# Altium schematic sheet [02] PMIC_POWER.SchDoc (part 1 of 3)
size B; DocumentNumber: 02; SheetNumber: 02; SheetTotal: 3
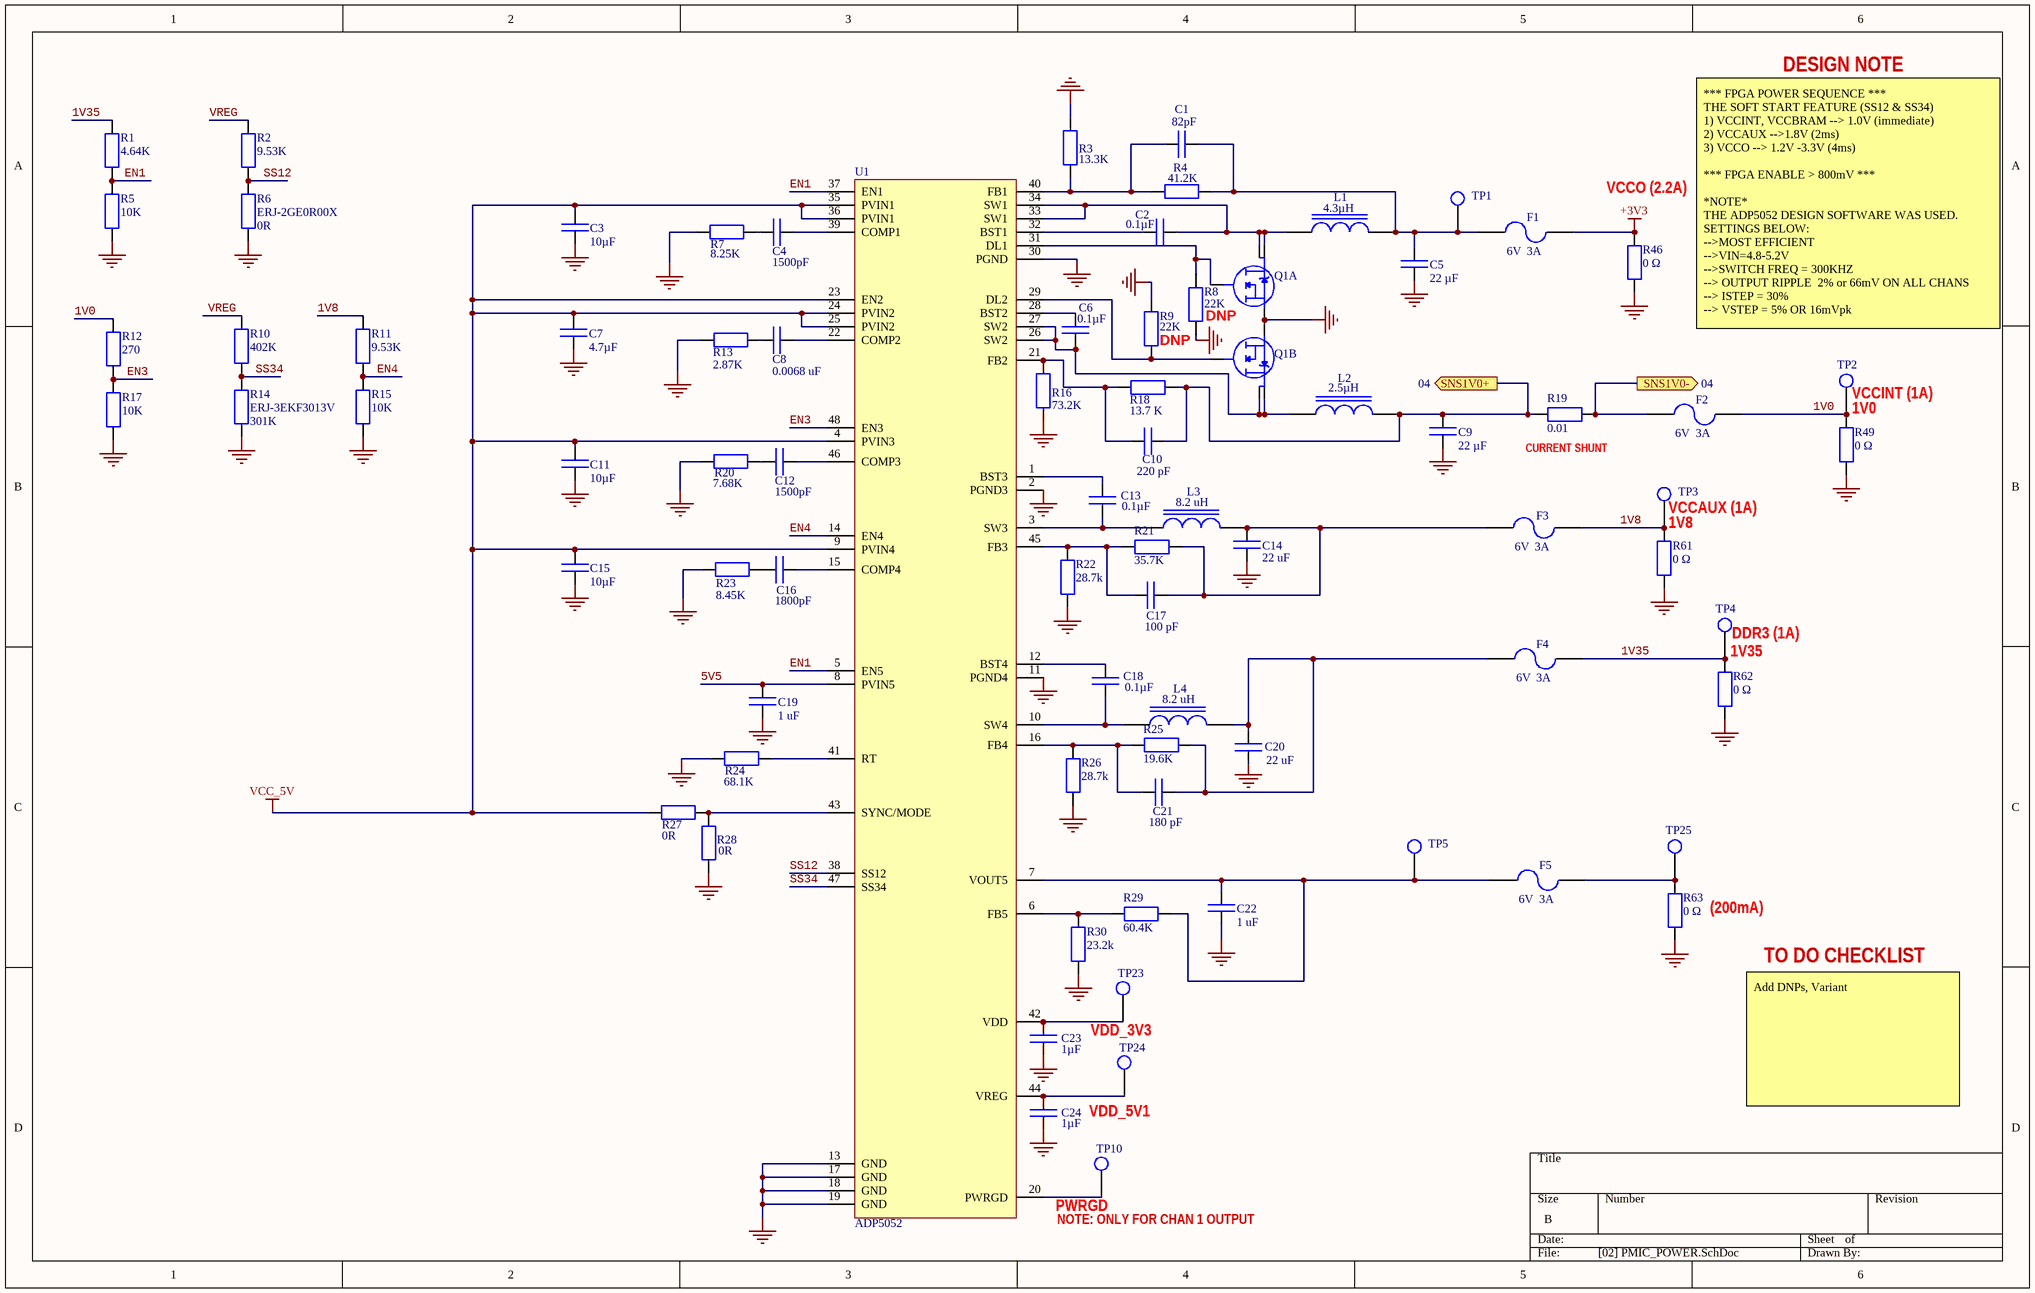
[diagram p0: [02] PMIC_POWER.SchDoc]

## Parts
C1  Capacitance: 82pF  [R0402]  (hidden comment: GCM1555C1H820FA16D)
C2  Capacitance: 0.1µF  [R0402]  (hidden comment: CC0402KRX7R6BB104)
C3  Capacitance: 10µF  [C1206]  (hidden comment: C3216X5R1C106M160AA)
C4  Capacitance: 1500pF  [R0402]  (hidden comment: GCM155R71H152KA37D)
C5  Capacitance: 22 µF  [C1206]  (hidden comment: 12063D226KAT2A)
C6  Capacitance: 0.1µF  [R0402]  (hidden comment: CC0402KRX7R6BB104)
C7  Capacitance: 4.7µF  [C0805_1]  (hidden comment: C2012X5R1C475K060AC)
C8  Capacitance Value: 0.0068 uF  [R0402]  (hidden comment: GCM155R71H682KA55D)
C9  Capacitance: 22 µF  [C1206]  (hidden comment: 12063D226KAT2A)
C10  Capacitance Value: 220 pF  [R0402]  (hidden comment: GCM155R71H221KA37D)
C11  Capacitance: 10µF  [C1206]  (hidden comment: C3216X5R1C106M160AA)
C12  Capacitance: 1500pF  [R0402]  (hidden comment: GCM155R71H152KA37D)
C13  Capacitance: 0.1µF  [R0402]  (hidden comment: CC0402KRX7R6BB104)
C14  Capacitance Value: 22 uF  [C0805_1]  (hidden comment: GRM21BR60J226ME39K)
C15  Capacitance: 10µF  [C1206]  (hidden comment: C3216X5R1C106M160AA)
C16  Capacitance: 1800pF  [C0805_1]  (hidden comment: GRM2165C2A182JA01D)
C17  Capacitance: 100 pF  [R0402]  (hidden comment: C0402C101K4GACTU)
C18  Capacitance: 0.1µF  [R0402]  (hidden comment: CC0402KRX7R6BB104)
C19  Capacitance: 1 uF  [C0603_1]  (hidden comment: C0603C105K8RACTU)
C20  Capacitance Value: 22 uF  [C0805_1]  (hidden comment: GRM21BR60J226ME39K)
C21  Capacitance: 180 pF  [R0402]  (hidden comment: C0402C181K5RACTU)
C22  Capacitance: 1 uF  [C0603_1]  (hidden comment: C0603C105K8RACTU)
C23  Capacitance: 1µF  (hidden comment: CC0402KRX5R5BB105)
C24  Capacitance: 1µF  (hidden comment: CC0402KRX5R5BB105)
F1  Voltage - Max: 6V  Current - Hold (Ih) (Max): 3A  [C1206 - PTC]  (hidden comment: MF-NSML300-2)
F2  Voltage - Max: 6V  Current - Hold (Ih) (Max): 3A  [C1206 - PTC]  (hidden comment: MF-NSML300-2)
F3  Voltage - Max: 6V  Current - Hold (Ih) (Max): 3A  [C1206 - PTC]  (hidden comment: MF-NSML300-2)
F4  Voltage - Max: 6V  Current - Hold (Ih) (Max): 3A  [C1206 - PTC]  (hidden comment: MF-NSML300-2)
F5  Voltage - Max: 6V  Current - Hold (Ih) (Max): 3A  [C1206 - PTC]  (hidden comment: MF-NSML300-2)
L1  Inductance: 4.3µH  [14.3uH_10_2mmX10_2mmX4mm]  (hidden comment: 7443552430)
L2  Inductance: 2.5µH  [2.5UH_10_2MMX10_2MM]  (hidden comment: 7447798250)
L3  Inductance: 8.2 uH  [8.2UH_5.28MMX5.28MM]  (hidden comment: XAL5050-822MEB)
L4  Inductance: 8.2 uH  [8.2UH_5.28MMX5.28MM]  (hidden comment: XAL5050-822MEB)
Q1  IRF8910  [8-SOIC]  (value not drawn)  (parts A,B of 2)
R1  Resistance: 4.64K  [R0603]  (hidden comment: ERJ-3EKF4641V)
R2  Resistance (Ohms): 9.53K  [R0603]  (hidden comment: ERJ-3EKF9531V)
R3  Resistance (Ohms): 13.3K  [R0805]  (hidden comment: CRCW080513K3FKEA)
R4  Resistance: 41.2K  [R0805]  (hidden comment: CRCW080541K2FKEA)
R5  Resistance: 10K  [R0603]  (hidden comment: ERJ-3EKF1002V)
R6  ERJ-2GE0R00X  Resistance (Ohms): 0R  [R0603]
R7  Resistance: 8.25K  [R0805]  (hidden comment: ERJ-6ENF8251V)
R8  Resistance: 22K  [R0402]  (hidden comment: CRCW040222K0FKED)
R9  Resistance: 22K  [R0402]  (hidden comment: CRCW040222K0FKED)
R10  Resistance (Ohms): 402K  [R0603]  (hidden comment: ERJ-3EKF4023V)
R11  Resistance (Ohms): 9.53K  [R0603]  (hidden comment: ERJ-3EKF9531V)
R12  Resistance: 270  [R0603]  (hidden comment: ERJ-3EKF2700V)
R13  Resistance (Ohms): 2.87K  [R0805]  (hidden comment: RC0805FR-072K87L)
R14  ERJ-3EKF3013V  Resistance: 301K  [R0603]
R15  Resistance: 10K  [R0603]  (hidden comment: ERJ-3EKF1002V)
R16  Resistance: 73.2K  [R0402]  (hidden comment: ERJ-2RKF7322X)
R17  Resistance: 10K  [R0603]  (hidden comment: ERJ-3EKF1002V)
R18  Resistance: 13.7 K  [R0402]  (hidden comment: ERJ-2RKF1372X)
R19  Resistance (Ohms): 0.01  [R0603]  (hidden comment: ERJ-3LWFR010V)
R20  Resistance (Ohms): 7.68K  [R0805]  (hidden comment: ERJ-6ENF7681V)
R21  Resistance: 35.7K  [R0402]  (hidden comment: ERJ-2RKF3572X)
R22  Resistance (Ohms): 28.7k  [R0402]  (hidden comment: CRCW040228K7FKED)
R23  Resistance: 8.45K  [R0805]  (hidden comment: ERJ-6ENF8451V)
R24  Resistance: 68.1K  [R0402]  (hidden comment: ERJ-2RKF6812X)
R25  Resistance: 19.6K  [R0402]  (hidden comment: ERJ-2RKF1962X)
R26  Resistance (Ohms): 28.7k  [R0402]  (hidden comment: CRCW040228K7FKED)
R27  Resistance (Ohms): 0R  [R0603]  (hidden comment: ERJ-2GE0R00X)
R28  Resistance (Ohms): 0R  [R0603]  (hidden comment: ERJ-2GE0R00X)
R29  Resistance: 60.4K  [R0402]  (hidden comment: ERJ-2RKF6042X)
R30  Resistance (Ohms): 23.2k  [R0402]  (hidden comment: ERJ-2RKF2322X)
R46  Resistance: 0 Ω  [R0805]  (hidden comment: ERJ-6GEY0R00V)
R49  Resistance: 0 Ω  [R0805]  (hidden comment: ERJ-6GEY0R00V)
R61  Resistance: 0 Ω  [R0805]  (hidden comment: ERJ-6GEY0R00V)
R62  Resistance: 0 Ω  [R0805]  (hidden comment: ERJ-6GEY0R00V)
R63  Resistance: 0 Ω  [R0805]  (hidden comment: ERJ-6GEY0R00V)
TP1  5017  [TEST_POINT]  (value not drawn)
TP2  5017  [TEST_POINT]  (value not drawn)
TP3  5017  [TEST_POINT]  (value not drawn)
TP4  5017  [TEST_POINT]  (value not drawn)
TP5  5017  [TEST_POINT]  (value not drawn)
TP10  5017  [TEST_POINT]  (value not drawn)
TP23  5017  [TEST_POINT]  (value not drawn)
TP24  5017  [TEST_POINT]  (value not drawn)
TP25  5017  [TEST_POINT]  (value not drawn)
U1  ADP5052  [48-LFSCP]

## Ports
SNS1V0+ (out, see 04), SNS1V0- (out, see 04)

## Nets
+3V3: F1.2 R46.1
GND: C3.1 C5.1 C7.1 C9.1 C11.1 C14.1 C15.1 C19.1 C20.1 C22.1 C23.1 C24.1 Q1.1(S1) Q1.3(S2) R3.2 R5.1 R6.1 R7.1 R8.1 R9.2 R13.1 R14.1 R15.1 R16.1 R17.1 R20.1 R22.1 R23.1 R24.1 R26.1 R28.2 R30.1 R46.2 R49.2 R61.2 R62.2 R63.2 U1.2(PGND3) U1.11(PGND4) U1.13(GND) U1.17(GND) U1.18(GND) U1.19(GND) U1.30(PGND)
VCC_5V: C3.2 C7.2 C11.2 C15.2 R27.2 U1.4(PVIN3) U1.9(PVIN4) U1.23(EN2) U1.24(PVIN2) U1.25(PVIN2) U1.35(PVIN1) U1.36(PVIN1)
1V0: F2.2 R12.2 R49.1 TP2.1
1V8: F3.2 R11.2 R61.1 TP3.1
1V35: F4.2 R1.2 R62.1 TP4.1
5V5: C19.2 U1.8(PVIN5)
EN1: R1.1 R5.2 U1.5(EN5) U1.37(EN1)
EN3: R12.1 R17.2 U1.48(EN3)
EN4: R11.1 R15.2 U1.14(EN4)
SNS1V0+: C9.2 C10.1 L2.2 R18.1 R19.1 ; port SNS1V0+
SNS1V0-: F2.1 R19.2 ; port SNS1V0-
SS12: R2.1 R6.2 U1.38(SS12)
SS34: R10.1 R14.2 U1.47(SS34)
VREG: R2.2 R10.2
NetC1_1: C1.1 C5.2 F1.1 L1.2 R4.2 TP1.1
NetC1_2: C1.2 R3.1 R4.1 U1.40(FB1)
NetC2_1: C2.1 L1.1 Q1.7(D1) Q1.8(D1) U1.33(SW1) U1.34(SW1)
NetC2_2: C2.2 U1.32(BST1)
NetC4_1: C4.1 U1.39(COMP1)
NetC4_2: C4.2 R7.2
NetC6_1: C6.1 U1.28(BST2)
NetC6_2: C6.2 L2.1 Q1.5(D2) Q1.6(D2) U1.26(SW2) U1.27(SW2)
NetC8_1: C8.1 U1.22(COMP2)
NetC8_2: C8.2 R13.2
NetC10_2: C10.2 R16.2 R18.2 U1.21(FB2)
NetC12_1: C12.1 U1.46(COMP3)
NetC12_2: C12.2 R20.2
NetC13_1: C13.1 U1.1(BST3)
NetC13_2: C13.2 L3.1 U1.3(SW3)
NetC14_2: C14.2 C17.1 F3.1 L3.2 R21.2
NetC16_1: C16.1 U1.15(COMP4)
NetC16_2: C16.2 R23.2
NetC17_2: C17.2 R21.1 R22.2 U1.45(FB3)
NetC18_1: C18.1 U1.12(BST4)
NetC18_2: C18.2 L4.1 U1.10(SW4)
NetC20_2: C20.2 C21.1 F4.1 L4.2 R25.2
NetC21_2: C21.2 R25.1 R26.2 U1.16(FB4)
NetC22_2: C22.2 F5.1 R29.2 TP5.1 U1.7(VOUT5)
NetC23_2: C23.2 TP23.1 U1.42(VDD)
NetC24_2: C24.2 TP24.1 U1.44(VREG)
NetF5_2: F5.2 R63.1 TP25.1
NetQ1_2: Q1.2(G1) R8.2 U1.31(DL1)
NetQ1_4: Q1.4(G2) R9.1 U1.29(DL2)
NetR24_2: R24.2 U1.41(RT)
NetR27_1: R27.1 R28.1 U1.43(SYNC/MODE)
NetR29_1: R29.1 R30.2 U1.6(FB5)
NetTP10_1: TP10.1 U1.20(PWRGD)

## Notes on the sheet
- DESIGN NOTE
- VCCO (2.2A)
- (near R9) DNP
- (near Q1) DNP
- *** FPGA POWER SEQUENCE ***
  THE SOFT START FEATURE (SS12 & SS34)
  1) VCCINT, VCCBRAM --> 1.0V (immediate)
  2) VCCAUX -->1.8V (2ms)
  3) VCCO --> 1.2V -3.3V (4ms)
  *** FPGA ENABLE > 800mV ***
  *NOTE*
  THE ADP5052 DESIGN SOFTWARE WAS USED. SETTINGS BELOW:
  -->MOST EFFICIENT
  -->VIN=4.8-5.2V
  -->SWITCH FREQ = 300KHZ
  --> OUTPUT RIPPLE  2% or 66mV ON ALL CHANS
  --> ISTEP = 30%
  --> VSTEP = 5% OR 16mVpk
- (near TP2) VCCINT (1A)
- 1V0
- (near R19) CURRENT SHUNT
- (near TP3) VCCAUX (1A)
- 1V8
- (near TP4) DDR3 (1A)
- 1V35
- (near R63) (200mA)
- TO DO CHECKLIST
- VDD_3V3
- Add DNPs, Variant
- VDD_5V1
- PWRGD
- NOTE: ONLY FOR CHAN 1 OUTPUT